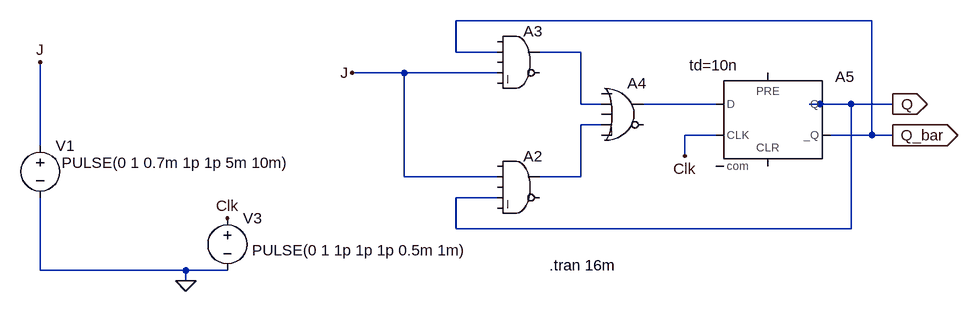
[diagram p0: schematic T_flipflop.asc]
T_flipflop.asc, the LTspice schematic file:
Version 4
SHEET 1 1092 680
WIRE 928 -48 288 -48
WIRE 288 0 288 -48
WIRE 352 0 288 0
WIRE 480 0 416 0
WIRE 208 32 128 32
WIRE 352 32 208 32
WIRE 480 80 480 0
WIRE 512 80 480 80
WIRE 688 80 576 80
WIRE 848 80 832 80
WIRE 896 80 848 80
WIRE 960 80 896 80
WIRE 512 112 480 112
WIRE 688 128 640 128
WIRE 928 128 928 -48
WIRE 928 128 864 128
WIRE 960 128 928 128
WIRE -352 144 -352 16
WIRE 640 160 640 128
WIRE 208 192 208 32
WIRE 352 192 208 192
WIRE 480 192 480 112
WIRE 480 192 416 192
WIRE 352 224 288 224
WIRE 288 272 288 224
WIRE 896 272 896 80
WIRE 896 272 288 272
WIRE -352 336 -352 224
WIRE -128 336 -352 336
WIRE -64 336 -128 336
WIRE -128 352 -128 336
FLAG 960 80 Q
IOPIN 960 80 Out
FLAG 960 128 Q_bar
IOPIN 960 128 Out
FLAG -128 352 0
FLAG -352 16 J
FLAG -64 256 Clk
FLAG 128 32 J
FLAG 640 160 Clk
SYMBOL Digital\\and 384 -48 R0
SYMATTR InstName A3
SYMBOL Digital\\or 544 32 R0
SYMATTR InstName A4
SYMBOL Digital\\dflop 768 32 R0
WINDOW 3 -121 -12 Left 2
SYMATTR Value td=10n
SYMATTR InstName A5
SYMBOL voltage -352 128 R0
WINDOW 3 33 42 Left 2
WINDOW 123 0 0 Left 0
WINDOW 39 0 0 Left 0
SYMATTR Value PULSE(0 1 0.7m 1p 1p 5m 10m)
SYMATTR InstName V1
SYMBOL voltage -64 240 R0
WINDOW 3 38 65 Left 2
WINDOW 123 0 0 Left 0
WINDOW 39 0 0 Left 0
SYMATTR Value PULSE(0 1 1p 1p 1p 0.5m 1m)
SYMATTR InstName V3
SYMBOL Digital\\and 384 144 R0
SYMATTR InstName A2
TEXT 432 328 Left 2 !.tran 16m

The netlist it stands for:
* T_flipflop.asc
A3 0 Q_bar 0 J 0 0 N001 0 AND
A4 0 N001 0 N003 0 0 N002 0 OR
A5 N002 0 Clk 0 0 Q_bar Q 0 DFLOP td=10n
V1 J 0 PULSE(0 1 0.7m 1p 1p 5m 10m)
V3 Clk 0 PULSE(0 1 1p 1p 1p 0.5m 1m)
A2 0 J 0 Q 0 0 N003 0 AND
.tran 16m
.backanno
.end